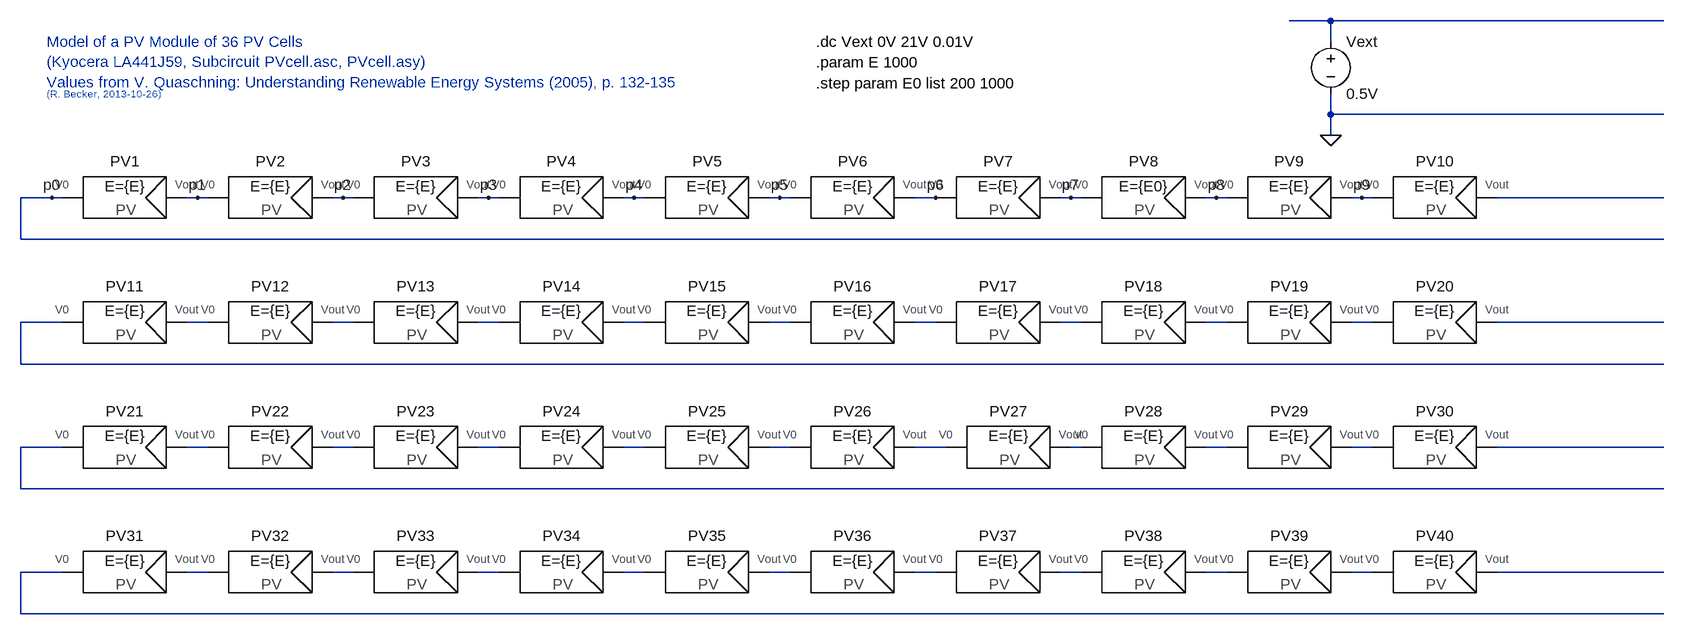
[diagram p0: schematic PVmodule_40Cells.asc]
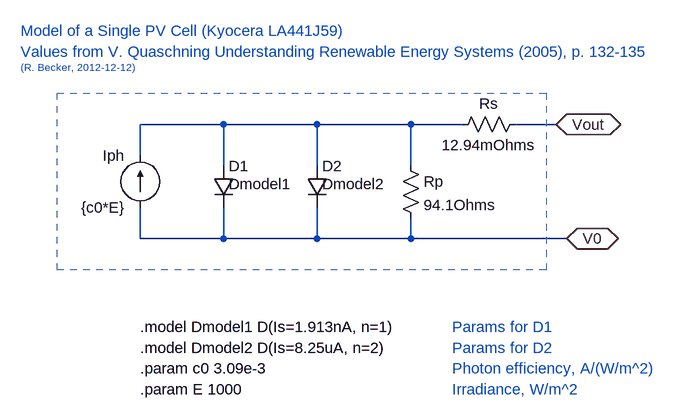
[diagram p1: sub-circuit pvcell.asc]
PVmodule_40Cells.asc, the LTspice schematic file:
Version 4
SHEET 1 2048 1588
WIRE 1440 32 1376 32
WIRE 1952 32 1440 32
WIRE 1440 64 1440 32
WIRE 1440 176 1440 144
WIRE 1952 176 1440 176
WIRE 1440 208 1440 176
WIRE -528 304 -576 304
WIRE -512 304 -528 304
WIRE -304 304 -320 304
WIRE -288 304 -304 304
WIRE -80 304 -96 304
WIRE -64 304 -80 304
WIRE 144 304 128 304
WIRE 160 304 144 304
WIRE 368 304 352 304
WIRE 384 304 368 304
WIRE 592 304 576 304
WIRE 608 304 592 304
WIRE 832 304 800 304
WIRE 1040 304 1024 304
WIRE 1056 304 1040 304
WIRE 1264 304 1248 304
WIRE 1280 304 1264 304
WIRE 1488 304 1472 304
WIRE 1504 304 1488 304
WIRE 1952 304 1696 304
WIRE -576 368 -576 304
WIRE 1952 368 -576 368
WIRE -512 496 -576 496
WIRE -288 496 -320 496
WIRE -64 496 -96 496
WIRE 160 496 128 496
WIRE 384 496 352 496
WIRE 608 496 576 496
WIRE 832 496 800 496
WIRE 1056 496 1024 496
WIRE 1280 496 1248 496
WIRE 1504 496 1472 496
WIRE 1952 496 1696 496
WIRE -576 560 -576 496
WIRE 1952 560 -576 560
WIRE -512 688 -576 688
WIRE -288 688 -320 688
WIRE -64 688 -96 688
WIRE 160 688 128 688
WIRE 384 688 352 688
WIRE 608 688 576 688
WIRE 848 688 800 688
WIRE 1056 688 1040 688
WIRE 1280 688 1248 688
WIRE 1504 688 1472 688
WIRE 1952 688 1696 688
WIRE -576 752 -576 688
WIRE 1952 752 -576 752
WIRE -512 880 -576 880
WIRE -288 880 -320 880
WIRE -64 880 -96 880
WIRE 160 880 128 880
WIRE 384 880 352 880
WIRE 608 880 576 880
WIRE 832 880 800 880
WIRE 1056 880 1024 880
WIRE 1280 880 1248 880
WIRE 1504 880 1472 880
WIRE 1952 880 1696 880
WIRE -576 944 -576 880
WIRE 1952 944 -576 944
FLAG 1440 208 0
FLAG -528 304 p0
FLAG -304 304 p1
FLAG -80 304 p2
FLAG 144 304 p3
FLAG 368 304 p4
FLAG 592 304 p5
FLAG 832 304 p6
FLAG 1040 304 p7
FLAG 1264 304 p8
FLAG 1488 304 p9
SYMBOL PVcell -416 304 R0
WINDOW 39 0 -2 Bottom 2
SYMATTR SpiceLine E={E}
SYMATTR InstName PV1
SYMATTR SpiceModel ""
SYMBOL voltage 1440 48 R0
WINDOW 123 0 0 Left 2
WINDOW 39 0 0 Left 2
SYMATTR InstName Vext
SYMATTR Value 0.5V
SYMBOL PVcell -192 304 R0
WINDOW 39 0 -2 Bottom 2
SYMATTR SpiceLine E={E}
SYMATTR InstName PV2
SYMATTR SpiceModel ""
SYMBOL PVcell 32 304 R0
WINDOW 39 0 -2 Bottom 2
SYMATTR SpiceLine E={E}
SYMATTR InstName PV3
SYMATTR SpiceModel ""
SYMBOL PVcell 256 304 R0
WINDOW 39 0 -2 Bottom 2
SYMATTR SpiceLine E={E}
SYMATTR InstName PV4
SYMATTR SpiceModel ""
SYMBOL PVcell 480 304 R0
WINDOW 39 0 -2 Bottom 2
SYMATTR SpiceLine E={E}
SYMATTR InstName PV5
SYMATTR SpiceModel ""
SYMBOL PVcell 704 304 R0
WINDOW 39 0 -2 Bottom 2
SYMATTR SpiceLine E={E}
SYMATTR InstName PV6
SYMATTR SpiceModel ""
SYMBOL PVcell 928 304 R0
WINDOW 39 0 -2 Bottom 2
SYMATTR SpiceLine E={E}
SYMATTR InstName PV7
SYMATTR SpiceModel ""
SYMBOL PVcell 1152 304 R0
WINDOW 39 0 -2 Bottom 2
SYMATTR SpiceLine E={E0}
SYMATTR InstName PV8
SYMATTR SpiceModel ""
SYMBOL PVcell 1376 304 R0
WINDOW 39 0 -2 Bottom 2
SYMATTR SpiceLine E={E}
SYMATTR InstName PV9
SYMATTR SpiceModel ""
SYMBOL PVcell 1600 304 R0
WINDOW 39 0 -2 Bottom 2
SYMATTR SpiceLine E={E}
SYMATTR InstName PV10
SYMATTR SpiceModel ""
SYMBOL PVcell -416 496 R0
WINDOW 39 0 -2 Bottom 2
SYMATTR SpiceLine E={E}
SYMATTR InstName PV11
SYMATTR SpiceModel ""
SYMBOL PVcell -192 496 R0
WINDOW 39 0 -2 Bottom 2
SYMATTR SpiceLine E={E}
SYMATTR InstName PV12
SYMATTR SpiceModel ""
SYMBOL PVcell 32 496 R0
WINDOW 39 0 -2 Bottom 2
SYMATTR SpiceLine E={E}
SYMATTR InstName PV13
SYMATTR SpiceModel ""
SYMBOL PVcell 256 496 R0
WINDOW 39 0 -2 Bottom 2
SYMATTR SpiceLine E={E}
SYMATTR InstName PV14
SYMATTR SpiceModel ""
SYMBOL PVcell 480 496 R0
WINDOW 39 0 -2 Bottom 2
SYMATTR SpiceLine E={E}
SYMATTR InstName PV15
SYMATTR SpiceModel ""
SYMBOL PVcell 704 496 R0
WINDOW 39 0 -2 Bottom 2
SYMATTR SpiceLine E={E}
SYMATTR InstName PV16
SYMATTR SpiceModel ""
SYMBOL PVcell 928 496 R0
WINDOW 39 0 -2 Bottom 2
SYMATTR SpiceLine E={E}
SYMATTR InstName PV17
SYMATTR SpiceModel ""
SYMBOL PVcell 1152 496 R0
WINDOW 39 0 -2 Bottom 2
SYMATTR SpiceLine E={E}
SYMATTR InstName PV18
SYMATTR SpiceModel ""
SYMBOL PVcell 1376 496 R0
WINDOW 39 0 -2 Bottom 2
SYMATTR SpiceLine E={E}
SYMATTR InstName PV19
SYMATTR SpiceModel ""
SYMBOL PVcell 1600 496 R0
WINDOW 39 0 -2 Bottom 2
SYMATTR SpiceLine E={E}
SYMATTR InstName PV20
SYMATTR SpiceModel ""
SYMBOL PVcell -416 688 R0
WINDOW 39 0 -2 Bottom 2
SYMATTR SpiceLine E={E}
SYMATTR InstName PV21
SYMATTR SpiceModel ""
SYMBOL PVcell -192 688 R0
WINDOW 39 0 -2 Bottom 2
SYMATTR SpiceLine E={E}
SYMATTR InstName PV22
SYMATTR SpiceModel ""
SYMBOL PVcell 32 688 R0
WINDOW 39 0 -2 Bottom 2
SYMATTR SpiceLine E={E}
SYMATTR InstName PV23
SYMATTR SpiceModel ""
SYMBOL PVcell 256 688 R0
WINDOW 39 0 -2 Bottom 2
SYMATTR SpiceLine E={E}
SYMATTR InstName PV24
SYMATTR SpiceModel ""
SYMBOL PVcell 480 688 R0
WINDOW 39 0 -2 Bottom 2
SYMATTR SpiceLine E={E}
SYMATTR InstName PV25
SYMATTR SpiceModel ""
SYMBOL PVcell 704 688 R0
WINDOW 39 0 -2 Bottom 2
SYMATTR SpiceLine E={E}
SYMATTR InstName PV26
SYMATTR SpiceModel ""
SYMBOL PVcell 944 688 R0
WINDOW 39 0 -2 Bottom 2
SYMATTR SpiceLine E={E}
SYMATTR InstName PV27
SYMATTR SpiceModel ""
SYMBOL PVcell 1152 688 R0
WINDOW 39 0 -2 Bottom 2
SYMATTR SpiceLine E={E}
SYMATTR InstName PV28
SYMATTR SpiceModel ""
SYMBOL PVcell 1376 688 R0
WINDOW 39 0 -2 Bottom 2
SYMATTR SpiceLine E={E}
SYMATTR InstName PV29
SYMATTR SpiceModel ""
SYMBOL PVcell 1600 688 R0
WINDOW 39 0 -2 Bottom 2
SYMATTR SpiceLine E={E}
SYMATTR InstName PV30
SYMATTR SpiceModel ""
SYMBOL PVcell -416 880 R0
WINDOW 39 0 -2 Bottom 2
SYMATTR SpiceLine E={E}
SYMATTR InstName PV31
SYMATTR SpiceModel ""
SYMBOL PVcell -192 880 R0
WINDOW 39 0 -2 Bottom 2
SYMATTR SpiceLine E={E}
SYMATTR InstName PV32
SYMATTR SpiceModel ""
SYMBOL PVcell 32 880 R0
WINDOW 39 0 -2 Bottom 2
SYMATTR SpiceLine E={E}
SYMATTR InstName PV33
SYMATTR SpiceModel ""
SYMBOL PVcell 256 880 R0
WINDOW 39 0 -2 Bottom 2
SYMATTR SpiceLine E={E}
SYMATTR InstName PV34
SYMATTR SpiceModel ""
SYMBOL PVcell 480 880 R0
WINDOW 39 0 -2 Bottom 2
SYMATTR SpiceLine E={E}
SYMATTR InstName PV35
SYMATTR SpiceModel ""
SYMBOL PVcell 704 880 R0
WINDOW 39 0 -2 Bottom 2
SYMATTR SpiceLine E={E}
SYMATTR InstName PV36
SYMATTR SpiceModel ""
SYMBOL PVcell 928 880 R0
WINDOW 39 0 -2 Bottom 2
SYMATTR SpiceLine E={E}
SYMATTR InstName PV37
SYMATTR SpiceModel ""
SYMBOL PVcell 1152 880 R0
WINDOW 39 0 -2 Bottom 2
SYMATTR SpiceLine E={E}
SYMATTR InstName PV38
SYMATTR SpiceModel ""
SYMBOL PVcell 1376 880 R0
WINDOW 39 0 -2 Bottom 2
SYMATTR SpiceLine E={E}
SYMATTR InstName PV39
SYMATTR SpiceModel ""
SYMBOL PVcell 1600 880 R0
WINDOW 39 0 -2 Bottom 2
SYMATTR SpiceLine E={E}
SYMATTR InstName PV40
SYMATTR SpiceModel ""
TEXT 648 64 Left 2 !.dc Vext 0V 21V 0.01V
TEXT 648 128 Left 2 !.step param E0 list 200 1000
TEXT -536 64 Left 2 ;Model of a PV Module of 36 PV Cells \n(Kyocera LA441J59, Subcircuit PVcell.asc, PVcell.asy)\nValues from V. Quaschning: Understanding Renewable Energy Systems (2005), p. 132-135
TEXT -536 144 Left 1 ;(R. Becker, 2013-10-26)
TEXT 648 96 Left 2 !.param E 1000

pvcell.asc, the sub-circuit schematic file:
Version 4
SHEET 1 880 680
WIRE 0 32 -128 32
WIRE 144 32 0 32
WIRE 288 32 144 32
WIRE 368 32 288 32
WIRE 512 32 448 32
WIRE -128 80 -128 32
WIRE 0 96 0 32
WIRE 144 96 144 32
WIRE 288 96 288 32
WIRE -128 208 -128 160
WIRE 0 208 0 160
WIRE 0 208 -128 208
WIRE 144 208 144 160
WIRE 144 208 0 208
WIRE 288 208 288 176
WIRE 288 208 144 208
WIRE 528 208 288 208
FLAG 512 32 Vout
IOPIN 512 32 BiDir
FLAG 528 208 V0
IOPIN 528 208 BiDir
SYMBOL diode -16 96 R0
WINDOW 3 24 28 Left 2
SYMATTR Value Dmodel1
SYMATTR InstName D1
SYMBOL current -128 160 R180
WINDOW 0 24 80 Left 2
WINDOW 3 24 0 Left 2
SYMATTR InstName Iph
SYMATTR Value {c0*E}
SYMBOL diode 128 96 R0
WINDOW 3 24 28 Left 2
SYMATTR Value Dmodel2
SYMATTR InstName D2
SYMBOL res 272 80 R0
SYMATTR InstName Rp
SYMATTR Value 94.1Ohms
SYMBOL res 464 16 R90
WINDOW 0 0 56 VBottom 2
WINDOW 3 32 56 VTop 2
SYMATTR InstName Rs
SYMATTR Value 12.94mOhms
TEXT -128 344 Left 2 !.model Dmodel1 D(Is=1.913nA, n=1)
TEXT -128 376 Left 2 !.model Dmodel2 D(Is=8.25uA, n=2)
TEXT -128 408 Left 2 !.param c0 3.09e-3
TEXT -312 -80 Left 2 ;Values from V. Quaschning Understanding Renewable Energy Systems (2005), p. 132-135
TEXT -312 -112 Left 2 ;Model of a Single PV Cell (Kyocera LA441J59)
TEXT -312 -56 Left 1 ;(R. Becker, 2012-12-12)
TEXT -128 440 Left 2 !.param E 1000
TEXT 352 440 Left 2 ;Irradiance, W/m^2
TEXT 352 408 Left 2 ;Photon efficiency, A/(W/m^2)
TEXT 352 344 Left 2 ;Params for D1
TEXT 352 376 Left 2 ;Params for D2
RECTANGLE Normal 496 256 -256 -16 1

The netlist it stands for:
* PVmodule_40Cells.asc
XPV1 p0 p1 pvcell params: E={E}
Vext N001 0 0.5V
XPV2 p1 p2 pvcell params: E={E}
XPV3 p2 p3 pvcell params: E={E}
XPV4 p3 p4 pvcell params: E={E}
XPV5 p4 p5 pvcell params: E={E}
XPV6 p5 p6 pvcell params: E={E}
XPV7 p6 p7 pvcell params: E={E}
XPV8 p7 p8 pvcell params: E={E0}
XPV9 p8 p9 pvcell params: E={E}
XPV10 p9 N002 pvcell params: E={E}
XPV11 N003 N004 pvcell params: E={E}
XPV12 N004 N005 pvcell params: E={E}
XPV13 N005 N006 pvcell params: E={E}
XPV14 N006 N007 pvcell params: E={E}
XPV15 N007 N008 pvcell params: E={E}
XPV16 N008 N009 pvcell params: E={E}
XPV17 N009 N010 pvcell params: E={E}
XPV18 N010 N011 pvcell params: E={E}
XPV19 N011 N012 pvcell params: E={E}
XPV20 N012 N013 pvcell params: E={E}
XPV21 N014 N015 pvcell params: E={E}
XPV22 N015 N016 pvcell params: E={E}
XPV23 N016 N017 pvcell params: E={E}
XPV24 N017 N018 pvcell params: E={E}
XPV25 N018 N019 pvcell params: E={E}
XPV26 N019 N020 pvcell params: E={E}
XPV27 N020 N021 pvcell params: E={E}
XPV28 N021 N022 pvcell params: E={E}
XPV29 N022 N023 pvcell params: E={E}
XPV30 N023 N024 pvcell params: E={E}
XPV31 N025 N026 pvcell params: E={E}
XPV32 N026 N027 pvcell params: E={E}
XPV33 N027 N028 pvcell params: E={E}
XPV34 N028 N029 pvcell params: E={E}
XPV35 N029 N030 pvcell params: E={E}
XPV36 N030 N031 pvcell params: E={E}
XPV37 N031 N032 pvcell params: E={E}
XPV38 N032 N033 pvcell params: E={E}
XPV39 N033 N034 pvcell params: E={E}
XPV40 N034 N035 pvcell params: E={E}

* block symbol definitions
.subckt pvcell V0 Vout
D1 N001 V0 Dmodel1
Iph V0 N001 {c0*E}
D2 N001 V0 Dmodel2
Rp N001 V0 94.1Ohms
Rs Vout N001 12.94mOhms
.model Dmodel1 D(Is=1.913nA, n=1)
.model Dmodel2 D(Is=8.25uA, n=2)
.param c0 3.09e-3
* Values from V. Quaschning Understanding Renewable Energy Systems (2005), p. 132-135
* Model of a Single PV Cell (Kyocera LA441J59)
* (R. Becker, 2012-12-12)
.param E 1000
* Irradiance, W/m^2
* Photon efficiency, A/(W/m^2)
* Params for D1
* Params for D2
.ends pvcell

.model D D
.lib standard.dio
.dc Vext 0V 21V 0.01V
.step param E0 list 200 1000
* Model of a PV Module of 36 PV Cells
* (Kyocera LA441J59, Subcircuit PVcell.asc, PVcell.asy)
* Values from V. Quaschning: Understanding Renewable Energy Systems (2005), p. 132-135
* (R. Becker, 2013-10-26)
.param E 1000
.backanno
.end